# EAGLE design TripleAttenumixer (EAGLE 6.4)
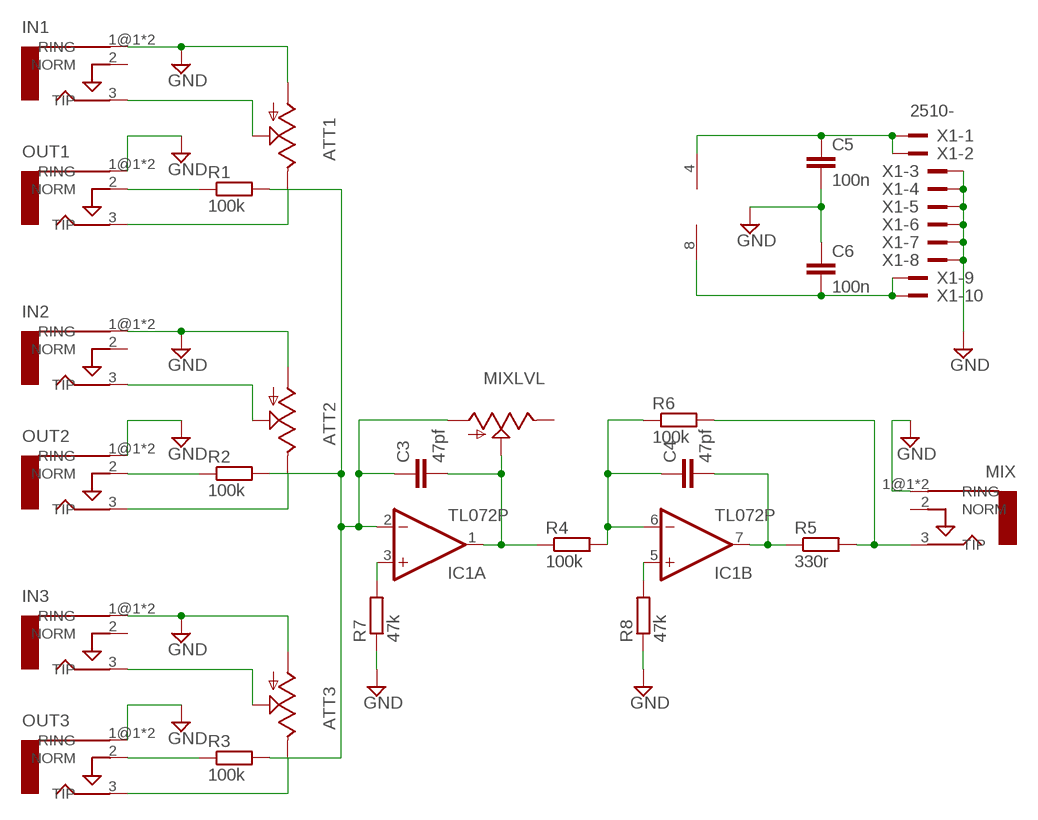
[diagram p0: schematic, sheet 1]

## Parts
ATT1  US-EVUF2A  [EVUF]
ATT2  US-EVUF2A  [EVUF]
ATT3  US-EVUF2A  [EVUF]
C3  47pf  C-EU025_050-025X075  [C025_050-025X075]
C4  47pf  C-EU025_050-025X075  [C025_050-025X075]
C5  100n  C-EU025_050-025X075  [C025_050-025X075]
C6  100n  C-EU025_050-025X075  [C025_050-025X075]
IC1  TL072P  [DIL08]
IN1  AUDIO-JACKERTHENVAR  [ERTHENVAR-JACK]
IN2  AUDIO-JACKERTHENVAR  [ERTHENVAR-JACK]
IN3  AUDIO-JACKERTHENVAR  [ERTHENVAR-JACK]
MIX  AUDIO-JACKERTHENVAR  [ERTHENVAR-JACK]
MIXLVL  US-EVUF2A  [EVUF]
OUT1  AUDIO-JACKERTHENVAR  [ERTHENVAR-JACK]
OUT2  AUDIO-JACKERTHENVAR  [ERTHENVAR-JACK]
OUT3  AUDIO-JACKERTHENVAR  [ERTHENVAR-JACK]
R1  100k  R-EU_0207/7  [0207/7]
R2  100k  R-EU_0207/7  [0207/7]
R3  100k  R-EU_0207/7  [0207/7]
R4  100k  R-EU_0207/7  [0207/7]
R5  330r  R-EU_0207/7  [0207/7]
R6  100k  R-EU_0207/7  [0207/7]
R7  47k  R-EU_0207/7  [0207/7]
R8  47k  R-EU_0207/7  [0207/7]
X1  2510-  [PAK100/2500-10]

## Nets
GND: ATT1.1(A) ATT2.1(A) ATT3.1(A) C5.2 C6.1 IN1.1@1(RING) IN1.1@2(RING) IN2.1@1(RING) IN2.1@2(RING) IN3.1@1(RING) IN3.1@2(RING) MIX.1@1(RING) MIX.1@2(RING) OUT1.1@1(RING) OUT1.1@2(RING) OUT2.1@1(RING) OUT2.1@2(RING) OUT3.1@1(RING) OUT3.1@2(RING) R7.1 R8.1 X1.3 X1.4 X1.5 X1.6 X1.7 X1.8
N$1: ATT1.2(S) IN1.3(TIP)
N$2: ATT1.3(E) OUT1.3(TIP)
N$3: ATT2.2(S) IN2.3(TIP)
N$4: ATT2.3(E) OUT2.3(TIP)
N$5: ATT3.2(S) IN3.3(TIP)
N$6: ATT3.3(E) OUT3.3(TIP)
N$7: OUT1.2(NORM) R1.1
N$8: OUT2.2(NORM) R2.1
N$9: OUT3.2(NORM) R3.1
N$10: C3.1 IC1.2(A:-IN) MIXLVL.1(A) R1.2 R2.2 R3.2
N$11: C3.2 IC1.1(A:OUT) MIXLVL.2(S) R4.1
N$13: C4.2 IC1.7(B:OUT) R5.1
N$14: IC1.3(A:+IN) R7.2
N$15: IC1.5(B:+IN) R8.2
N$16: MIX.3(TIP) R5.2 R6.2
N$17: C4.1 IC1.6(B:-IN) R4.2 R6.1
N$18: C5.1 IC1.4(P:V-) X1.1 X1.2
N$19: C6.2 IC1.8(P:V+) X1.9 X1.10
Unconnected: IN1.2(NORM) IN2.2(NORM) IN3.2(NORM) MIX.2(NORM) MIXLVL.3(E)

## Library data of the parts
ATT1-ATT3 MIXLVL = pot:US-EVU: 9 mm Square Rotary Potentiometers Source: Panasonic; OC_FARNELL: unknown
C3 C4 = rcl:C-EU: CAPACITOR, European symbol; OC_FARNELL: unknown
C5 C6 = rcl:C-EU: CAPACITOR, European symbol; MF: COOPER BUSSMANN; MPN: 100NHG000B; OC_FARNELL: 1701405
IC1 = linear:TL072: OP AMP; OC_FARNELL: unknown
IN1-IN3 MIX OUT1-OUT3 = erthenvar:AUDIO-JACK: Switching Mono 3.5mm Audio Jack from Erthenvar.; OC_FARNELL: unknown
R1-R8 = rcl:R-EU_: RESISTOR, European symbol; OC_FARNELL: unknown
X1 = con-3m:2510-: 3M (TM) Pak 100 4-Wall Header Source: 3M; MF: 3M; MPN: N2510-6002RB.; OC_FARNELL: 9838244; OC_NEWARK: 46F4725

## Board
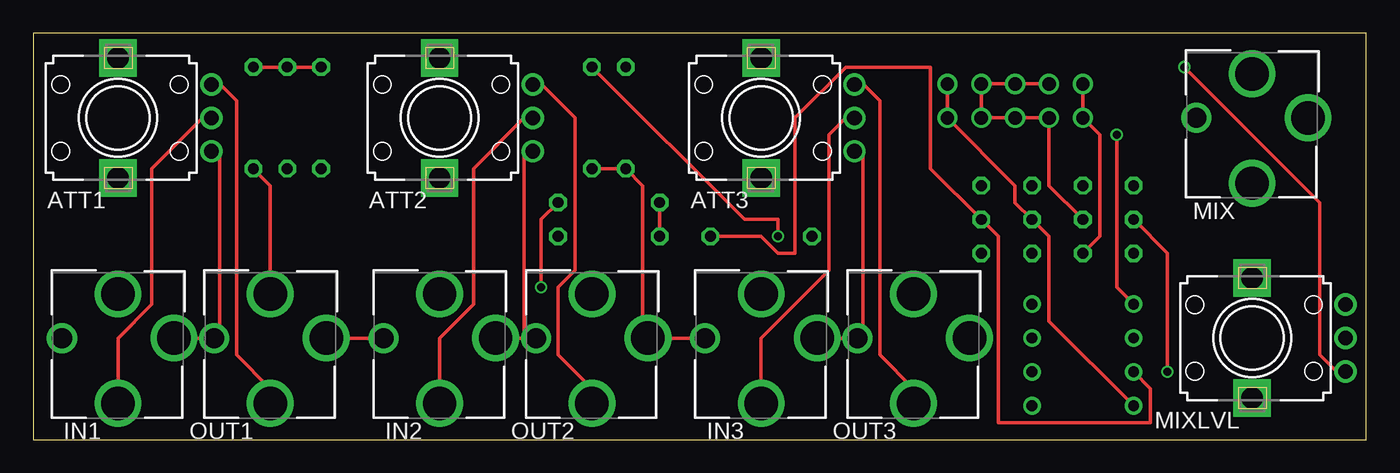
[diagram p1: board, top side]
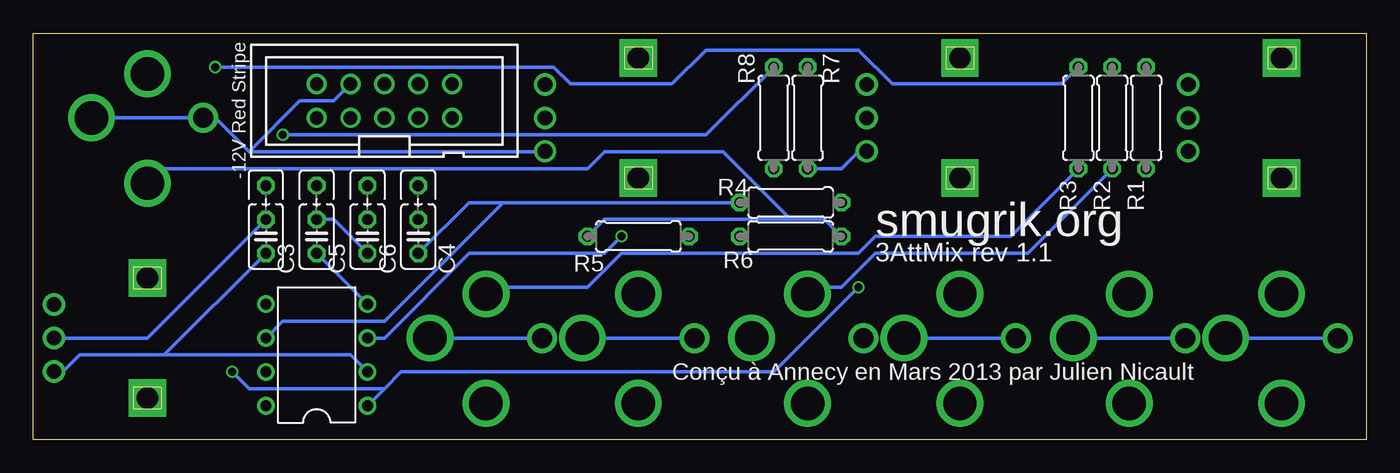
[diagram p2: board, bottom side, seen from below]

Size 100 x 30.47 mm. Coordinates in mm from the lower left corner, seen from the top.
Outline: 0,0 100,0 100,30.47 0,30.47 0,0
Copper layers (1*16): Top 0.035mm / dielectric 1.5mm / Bottom 0.035mm
Design rules "ITEADstudio_DRC": minimum track width 6mil, minimum drill 12mil, track to track 6mil, track to pad 6mil, pad to pad 6mil, via to via 6mil, smd to smd 0mil, copper to edge 10mil, drill to drill 10mil, minimum pad ring 10mil, minimum via ring 6mil, stop-mask expansion 2mil, vias tented up to drill 100mil, thermal gap 10mil

### Footprints (pad centres in the part's own frame; a part is rotated, then mirrored left to right if it is on the bottom)
EVUF = drill 1.1 pad 1.676: 1 -2.5,-7; 2 0,-7; 3 2.5,-7 | drill 1.6 pad 2.8 square: M1 4.5,0; M2 -4.5,0
C025_050-025X075 = drill 0.813 octagon: 1 -1.27,0; 2 1.27,0; 3 3.81,0
DIL08 = drill 0.813 pad 1.27: 1 -3.81,-3.81; 2 -1.27,-3.81; 3 1.27,-3.81; 4 3.81,-3.81; 5 3.81,3.81; 6 1.27,3.81; 7 -1.27,3.81; 8 -3.81,3.81
ERTHENVAR-JACK = drill 2.5: 1@1 -4.2,0; 2 0,-3.3; 3 0,4.9 | drill 1.5: 1@2 4.2,0
0207/7 = drill 0.813 octagon: 1 -3.81,0; 2 3.81,0
PAK100/2500-10 = drill 1 pad 1.422: 1 -5.08,-1.27; 2 -5.08,1.27; 3 -2.54,-1.27; 4 -2.54,1.27; 5 0,-1.27; 6 0,1.27; 7 2.54,-1.27; 8 2.54,1.27; 9 5.08,-1.27; 10 5.08,1.27

### Placement (x,y rotation side)
ATT1  6.35,24.13 90 top
ATT2  30.48,24.13 90 top
ATT3  54.61,24.13 90 top
C3  82.55,15.24 90 bottom
C4  71.12,15.24 90 bottom
C5  78.74,15.24 90 bottom
C6  74.93,15.24 90 bottom
IC1  78.74,6.35 90 bottom
IN1  6.35,7.62 180 top
IN2  30.48,7.62 180 top
IN3  54.61,7.62 180 top
MIX  91.44,24.13 180 top
MIXLVL  91.44,7.62 90 top
OUT1  17.78,7.62 180 top
OUT2  41.91,7.62 180 top
OUT3  66.04,7.62 180 top
R1  16.51,24.13 90 bottom
R2  19.05,24.13 90 bottom
R3  21.59,24.13 90 bottom
R4  43.18,17.78 180 bottom
R5  54.61,15.24 180 bottom
R6  43.18,15.24 0 bottom
R7  41.91,24.13 90 bottom
R8  44.45,24.13 90 bottom
X1  73.66,25.4 0 bottom

### Tracks (layer width: path | path; a pad name or v marks a point on that pad's centre or on a via)
GND
  Top 0.254: IN2.1@1 36.83,7.62 | OUT1.1@1 IN2.1@2 | ATT1.1 13.97,21.59 13.97,7.62 OUT1.1@2 IN1.1@1 | R7.1 R8.1 45.72,19.05 45.72,7.62 OUT2.1@1 IN3.1@2 | X1.4 X1.6 X1.8 X1.7 X1.5 X1.3 76.2,19.05 C5.2 | ATT3.1 62.23,21.59 62.23,7.62 OUT3.1@2 IN3.1@1 | 36.83,7.62 36.83,21.59 ATT2.1 | 36.83,7.62 OUT2.1@2
  Bottom 0.254: IN2.1@2 IN2.1@1 | IN1.1@1 IN1.1@2 | OUT1.1@2 OUT1.1@1 | R7.1 39.37,20.32 38.1,21.59 ATT2.1 | C6.1 77.47,16.51 C5.2 | MIX.1@1 MIX.1@2 86.36,24.13 83.82,21.59 | OUT3.1@2 OUT3.1@1 | 83.82,21.59 62.23,21.59 ATT3.1 | X1.4 77.47,25.4 80.01,25.4 83.82,21.59 | IN3.1@1 IN3.1@2
N$1
  Top 0.254: IN1.3 6.35,7.62 8.89,10.16 8.89,20.32 12.7,24.13 ATT1.2
N$2
  Top 0.254: ATT1.3 13.97,26.67 15.24,25.4 15.24,6.35 17.78,3.81 OUT1.3
N$3
  Top 0.254: IN2.3 30.48,7.62 33.02,10.16 33.02,20.32 36.83,24.13 ATT2.2
N$4
  Top 0.254: ATT2.3 38.1,26.67 40.64,24.13 40.64,12.7 39.37,11.43 39.37,6.35 41.91,3.81 OUT2.3
N$5
  Top 0.254: IN3.3 54.61,7.62 59.69,12.7 59.69,22.86 60.96,24.13 ATT3.2
N$6
  Top 0.254: ATT3.3 62.23,26.67 63.5,25.4 63.5,6.35 66.04,3.81 OUT3.3
N$7
  Top 0.254: R1.1 17.78,19.05 OUT1.2
N$8
  Bottom 0.254: R2.1 25.4,13.97 36.83,13.97 39.37,11.43 41.91,11.43 OUT2.2
N$9
  Bottom 0.254: R3.1 26.67,15.24 36.83,15.24 38.1,13.97 55.88,13.97 58.42,11.43 66.04,11.43 OUT3.2
N$10  (via drill 0.61)
  Top 0.254: R1.2 R2.2 R3.2 | v86.36,27.94 96.52,17.78 96.52,6.35 97.79,5.08 MIXLVL.1
  Bottom 0.254: IC1.2 76.2,6.35 90.17,6.35 | 90.17,6.35 96.52,6.35 97.79,5.08 MIXLVL.1 | 90.17,6.35 C3.1 | R3.2 22.86,26.67 35.56,26.67 38.1,29.21 49.53,29.21 52.07,26.67 59.69,26.67 60.96,27.94 v86.36,27.94
N$11  (via drill 0.61)
  Top 0.254: R4.1 38.1,16.51 v38.1,11.43 | C3.2 85.09,13.97 v85.09,5.08
  Bottom 0.254: C3.2 91.44,7.62 MIXLVL.2 | v38.1,11.43 44.45,5.08 72.39,5.08 73.66,3.81 | IC1.1 73.66,3.81 | v85.09,5.08 83.82,3.81 73.66,3.81
N$13
  Top 0.254: R5.1 54.61,15.24 55.88,13.97 57.15,13.97 57.15,24.13 60.96,27.94 67.31,27.94 67.31,20.32 C4.2 72.39,15.24 72.39,1.27 83.82,1.27 83.82,3.81 IC1.7
N$14  (via drill 0.61)
  Top 0.254: R7.2 53.34,16.51 55.88,16.51 v55.88,15.24
  Bottom 0.254: v55.88,15.24 57.15,13.97 67.31,13.97 73.66,7.62 IC1.3
N$15  (via drill 0.61)
  Top 0.254: v81.28,22.86 81.28,11.43 IC1.5
  Bottom 0.254: R8.2 49.53,22.86 v81.28,22.86
N$16
  Bottom 0.254: R6.2 40.64,16.51 43.18,16.51 | 43.18,16.51 57.15,16.51 R5.2 | 43.18,16.51 48.26,21.59 57.15,21.59 58.42,20.32 91.44,20.32 MIX.3
N$17
  Top 0.254: R4.2 R6.1
  Bottom 0.254: C4.1 67.31,17.78 64.77,17.78 | R4.2 64.77,17.78 | IC1.6 81.28,8.89 73.66,8.89 64.77,17.78
N$18
  Top 0.254: X1.2 X1.1 80.01,22.86 80.01,15.24 C5.1
  Bottom 0.254: C5.1 IC1.4
N$19
  Top 0.254: X1.10 X1.9 73.66,19.05 73.66,17.78 C6.2 76.2,15.24 76.2,8.89 IC1.8

### Text on the board
bNames: -12V Red Stripe | smugrik.org | 3AttMix rev 1.1 | Conçu à Annecy en Mars 2013 par Julien Nicault